# Altium schematic sheet Stingray.schdoc
size 543 x 428 mm
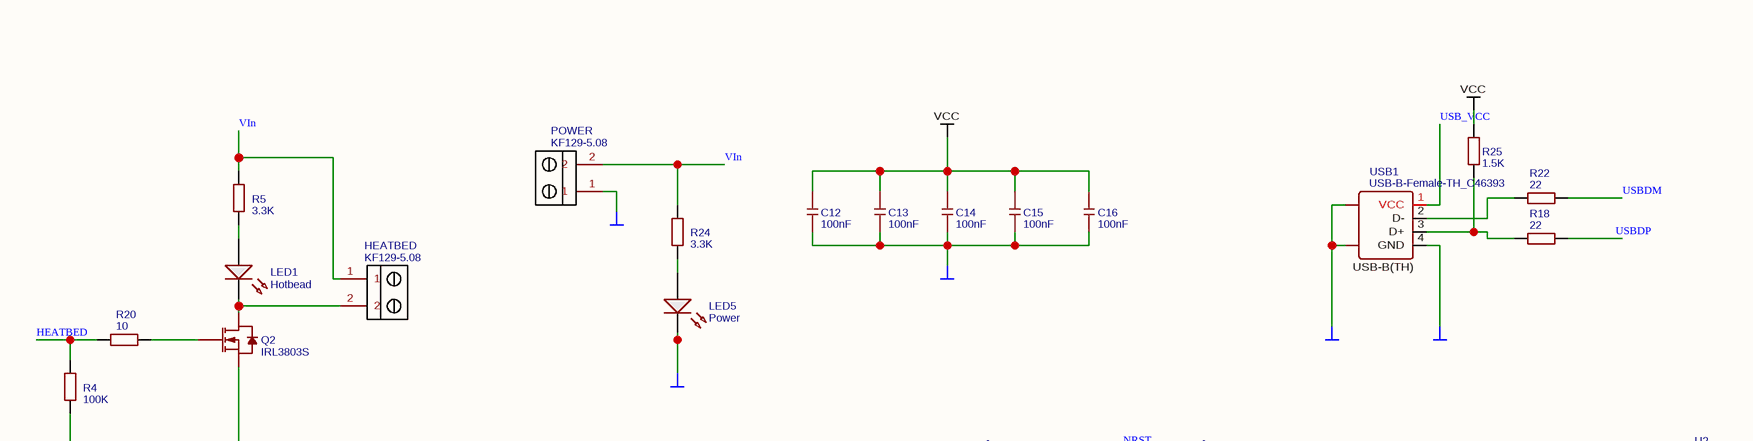
[diagram p0: Stingray.schdoc, top left]
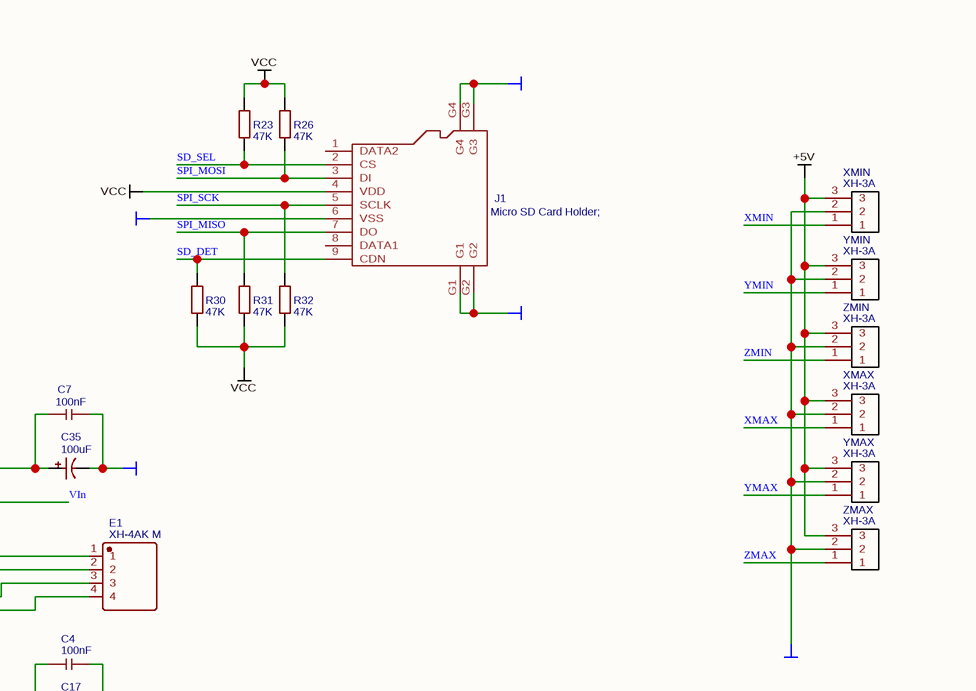
[diagram p1: Stingray.schdoc, top right]
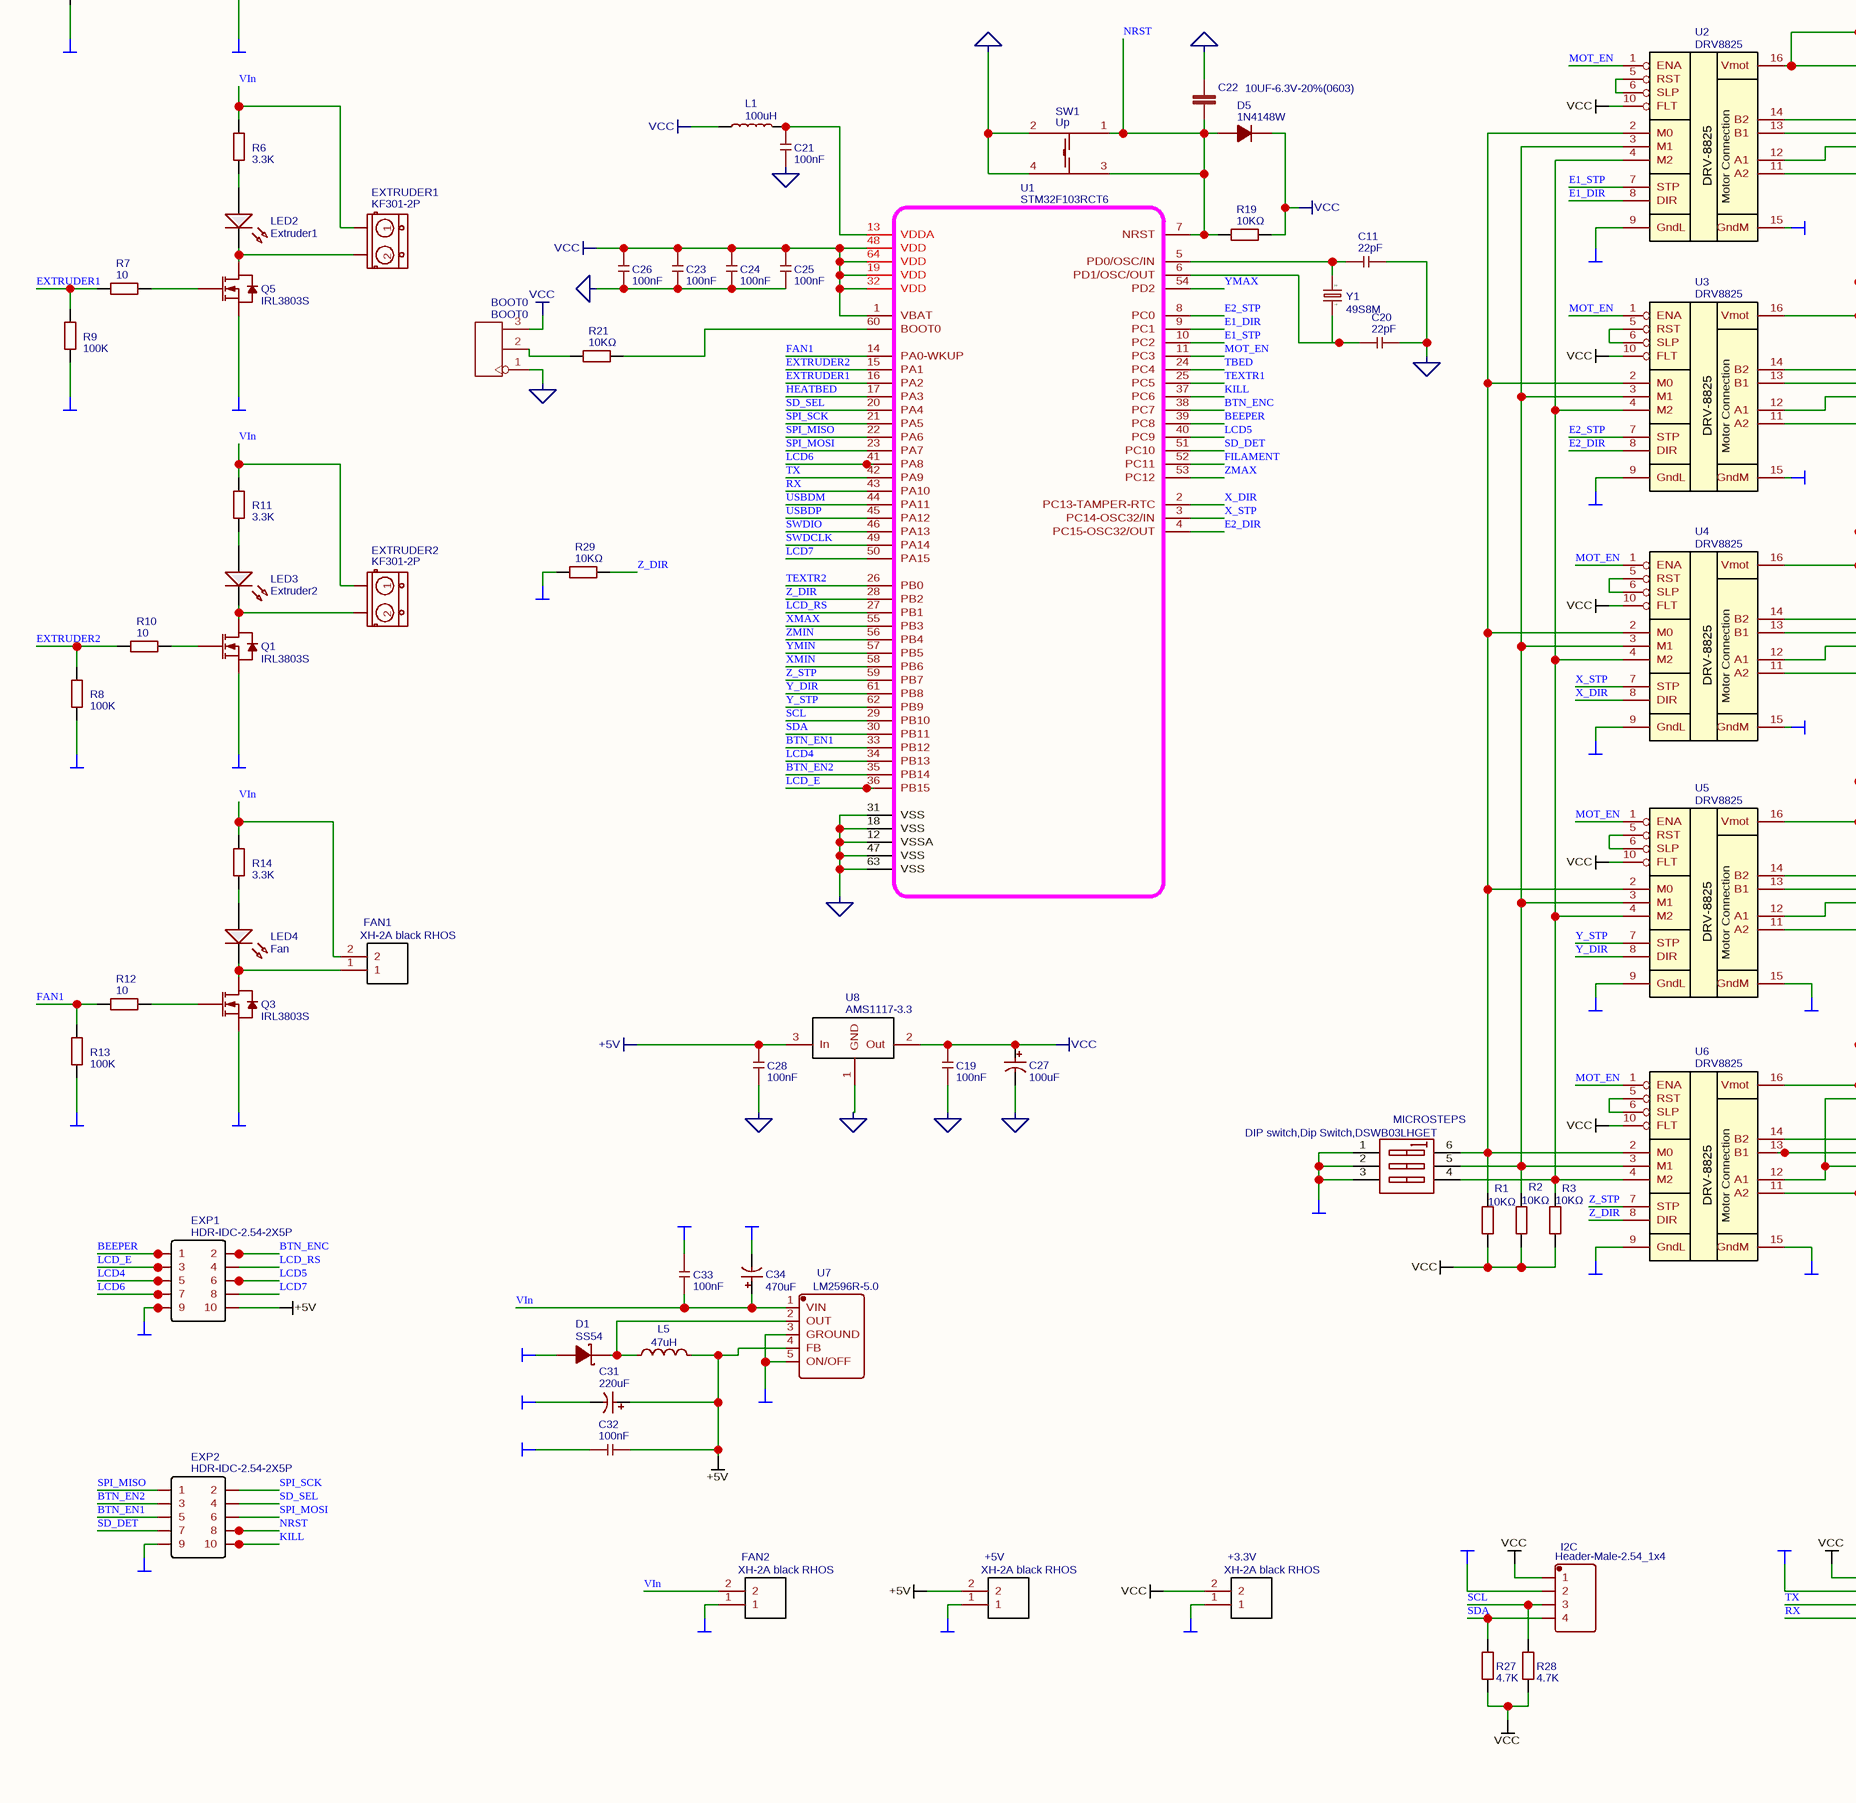
[diagram p2: Stingray.schdoc, bottom left]
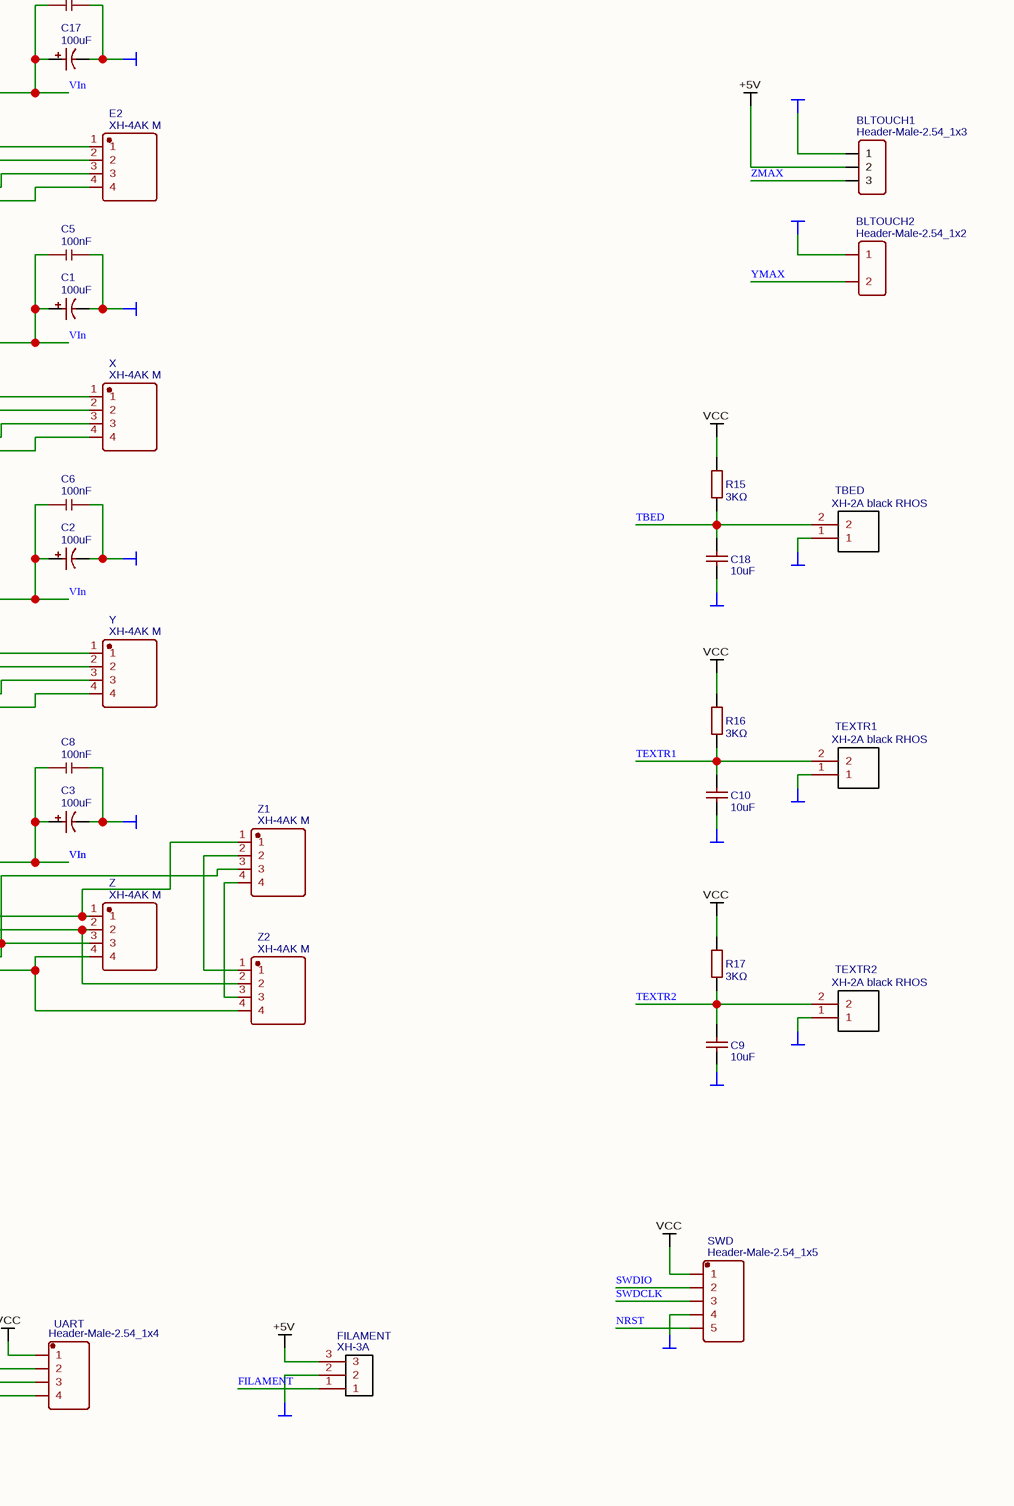
[diagram p3: Stingray.schdoc, bottom right]

## Parts
+3.3V  XH-2A black RHOS  [XH-2A]
+5V  XH-2A black RHOS  [XH-2A]
BLTOUCH1  Header-Male-2.54_1x3  [HDR-3X1/2.54]
BLTOUCH2  Header-Male-2.54_1x2  [HDR-2X1/2.54]
BOOT0  BOOT0  [H3-2.54]
C1  100uF  [CAP-D6.3XH7.7]
C2  100uF  [CAP-D6.3XH7.7]
C3  100uF  [CAP-D6.3XH7.7]
C4  100nF  [C0603]
C5  100nF  [C0603]
C6  100nF  [C0603]
C7  100nF  [C0603]
C8  100nF  [C0603]
C9  10uF  [0603]
C10  10uF  [0603]
C11  22pF  [C0603]
C12  100nF  [C0603]
C13  100nF  [C0603]
C14  100nF  [C0603]
C15  100nF  [C0603]
C16  100nF  [C0603]
C17  100uF  [CAP-D6.3XH7.7]
C18  10uF  [0603]
C19  100nF  [C0603]
C20  22pF  [C0603]
C21  100nF  [C0603]
C22  10UF-6.3V-20%(0603)  [0603-CAP]
C23  100nF  [C0603]
C24  100nF  [C0603]
C25  100nF  [C0603]
C26  100nF  [C0603]
C27  100uF  [CAP-D6.3XH5.5]
C28  100nF  [C0603]
C31  220uF  [CAP-D6.3XH5.5]
C32  100nF  [C0603]
C33  100nF  [C0603]
C34  470uF  [CAP-D12.5XH13.5]
C35  100uF  [CAP-D6.3XH7.7]
D1  SS54  [SMB(DO-214AA)]
D5  1N4148W  [SOD-123]
E1  XH-4AK M  [XH-4A]
E2  XH-4AK M  [XH-4A]
EXP1  HDR-IDC-2.54-2X5P  [HDR-IDC-2.54-2X5P]
EXP2  HDR-IDC-2.54-2X5P  [HDR-IDC-2.54-2X5P]
EXTRUDER1  KF301-2P  [KF301-2P]
EXTRUDER2  KF301-2P  [KF301-2P]
FAN1  XH-2A black RHOS  [XH-2A]
FAN2  XH-2A black RHOS  [XH-2A]
FILAMENT  XH-3A  [XH-3A]
HEATBED  KF129-5.08  [KF129-5.08]
I2C  Header-Male-2.54_1x4  [210S-1X4P]
J1  Micro SD Card Holder;  [MICRO-SD9+4P-SMD-16.1X14.5X1.85MM]
L1  100uH  [AXIAL-0.5]
L5  47uH  [SMD-10.0X10.0-10A50]
LED1  Hotbead  [LED-0805]
LED2  Extruder1  [LED-0805]
LED3  Extruder2  [LED-0805]
LED4  Fan  [LED-0805]
LED5  Power  [LED-0805]
MICROSTEPS  DIP switch,Dip Switch,DSWB03LHGET  [DSWB03LHGET]
POWER  KF129-5.08  [KF129-5.08]
Q1  IRL3803S  [TO-263-2-COLD]
Q2  IRL3803S  [TO-263-2-COLD]
Q3  IRL3803S  [TO-263-2-COLD]
Q5  IRL3803S  [TO-263-2-COLD]
R1  10KΩ  [0603]
R2  10KΩ  [0603]
R3  10KΩ  [0603]
R4  100K  [0603]
R5  3.3K  [0603]
R6  3.3K  [0603]
R7  10  [0603]
R8  100K  [0603]
R9  100K  [0603]
R10  10  [0603]
R11  3.3K  [0603]
R12  10  [0603]
R13  100K  [0603]
R14  3.3K  [0603]
R15  3KΩ  [0603]
R16  3KΩ  [0603]
R17  3KΩ  [0603]
R18  22  [0603]
R19  10KΩ  [0603]
R20  10  [0603]
R21  10KΩ  [0603]
R22  22  [0603]
R23  47K  [0603]
R24  3.3K  [0603]
R25  1.5K  [0603]
R26  47K  [0603]
R27  4.7K  [0603]
R28  4.7K  [0603]
R29  10KΩ  [0603]
R30  47K  [0603]
R31  47K  [0603]
R32  47K  [0603]
SW1  Up  [KEY-6.0*6.0]
SWD  Header-Male-2.54_1x5  [DIP-1X5P-2.54MM-M]
TBED  XH-2A black RHOS  [XH-2A]
TEXTR1  XH-2A black RHOS  [XH-2A]
TEXTR2  XH-2A black RHOS  [XH-2A]
U1  STM32F103RCT6  [LQFP64-0.5-10X10MM]
U2  DRV8825  [DRV8825]
U3  DRV8825  [DRV8825]
U4  DRV8825  [DRV8825]
U5  DRV8825  [DRV8825]
U6  DRV8825  [DRV8825]
U7  LM2596R-5.0  [TO-263-5-COLD]
U8  AMS1117-3.3  [SOT-223]
UART  Header-Male-2.54_1x4  [210S-1X4P]
USB1  USB-B-Female-TH_C46393  [USB-M-49]
X  XH-4AK M  [XH-4A]
XMAX  XH-3A  [XH-3A]
XMIN  XH-3A  [XH-3A]
Y  XH-4AK M  [XH-4A]
Y1  49S8M  [HC49US]
YMAX  XH-3A  [XH-3A]
YMIN  XH-3A  [XH-3A]
Z  XH-4AK M  [XH-4A]
Z1  XH-4AK M  [XH-4A]
Z2  XH-4AK M  [XH-4A]
ZMAX  XH-3A  [XH-3A]
ZMIN  XH-3A  [XH-3A]

## Nets
+5V: +5V.2 BLTOUCH1.2 C28.1 C31.1 C32.1 EXP1.10 FILAMENT.3 L5.2 U7.4(FB) U8.3(In) XMAX.3 XMIN.3 YMAX.3 YMIN.3 ZMAX.3 ZMIN.3
GND: +3.3V.1 +5V.1 BLTOUCH1.1 BLTOUCH2.1 BOOT0.1(P$1) C1.2 C2.2 C3.2 C4.2 C5.2 C6.2 C7.2 C8.2 C9.1 C10.1 C11.2 C12.2 C13.2 C14.2 C15.2 C16.2 C17.2 C18.1 C19.1 C20.2 C21.2 C22.1 C23.2 C24.2 C25.2 C26.2 C27.2 C28.2 C31.2 C32.2 C33.1 C34.2 C35.2 D1.1(A) EXP1.9 EXP2.9 FAN2.1 FILAMENT.2 I2C.2 J1.6(VSS) J1.G1 J1.G2 J1.G3 J1.G4 LED5.2(C) MICROSTEPS.1(A1) MICROSTEPS.2(A2) MICROSTEPS.3(A3) POWER.1 Q1.3(S) Q2.3(S) Q3.3(S) Q5.3(S) R4.2 R8.2 R9.2 R13.2 R29.2 SW1.2 SW1.4 SWD.4 TBED.1 TEXTR1.1 TEXTR2.1 U1.12(VSSA) U1.18(VSS) U1.31(VSS) U1.47(VSS) U1.63(VSS) U2.9(GndL) U2.15(GndM) U3.9(GndL) U3.15(GndM) U4.9(GndL) U4.15(GndM) U5.9(GndL) U5.15(GndM) U6.9(GndL) U6.15(GndM) U7.3(GROUND) U7.5(ON/OFF) U8.1(GND) UART.2 USB1.0 USB1.4(GND) XMAX.2 XMIN.2 YMAX.2 YMIN.2 ZMAX.2 ZMIN.2
VCC: +3.3V.2 BOOT0.3(P$3) C12.1 C13.1 C14.1 C15.1 C16.1 C19.2 C23.1 C24.1 C25.1 C26.1 C27.1 D5.2(K) I2C.1 J1.4(VDD) L1.1 R1.2 R2.2 R3.2 R15.2 R16.2 R17.2 R19.2 R23.1 R25.1 R26.1 R27.2 R28.2 R30.2 R31.2 R32.2 SWD.1 U1.1(VBAT) U1.19(VDD) U1.32(VDD) U1.48(VDD) U1.64(VDD) U2.10(FLT) U3.10(FLT) U4.10(FLT) U5.10(FLT) U6.10(FLT) U8.2(Out) UART.1
BEEPER: EXP1.1 U1.39(PC8)
BTN_EN1: EXP2.5 U1.33(PB12)
BTN_EN2: EXP2.3 U1.35(PB14)
BTN_ENC: EXP1.2 U1.38(PC7)
E1_DIR: U1.9(PC1) U2.8(DIR)
E1_STP: U1.10(PC2) U2.7(STP)
E2_DIR: U1.4(PC15-OSC32/OUT) U3.8(DIR)
E2_STP: U1.8(PC0) U3.7(STP)
EXTRUDER1: R7.2 R9.1 U1.16(PA2)
EXTRUDER2: R8.1 R10.2 U1.15(PA1)
FAN1: R12.2 R13.1 U1.14(PA0-WKUP)
FILAMENT: FILAMENT.1 U1.52(PC11)
HEATBED: R4.1 R20.2 U1.17(PA3)
KILL: EXP2.10 U1.37(PC6)
LCD4: EXP1.5 U1.34(PB13)
LCD5: EXP1.6 U1.40(PC9)
LCD6: EXP1.7 U1.41(PA8)
LCD7: EXP1.8 U1.50(PA15)
LCD_E: EXP1.3 U1.36(PB15)
LCD_RS: EXP1.4 U1.27(PB1)
MOT_EN: U1.11(PC3) U2.1(ENA) U3.1(ENA) U4.1(ENA) U5.1(ENA) U6.1(ENA)
NRST: C22.2 D5.1(A) EXP2.8 R19.1 SW1.1 SW1.3 SWD.5 U1.7(NRST)
RX: U1.43(PA10) UART.4
SCL: I2C.3 R28.1 U1.29(PB10)
SD_DET: EXP2.7 J1.9(CDN) R30.1 U1.51(PC10)
SD_SEL: EXP2.4 J1.2(CS) R23.2 U1.20(PA4)
SDA: I2C.4 R27.1 U1.30(PB11)
SPI_MISO: EXP2.1 J1.7(DO) R31.1 U1.22(PA6)
SPI_MOSI: EXP2.6 J1.3(DI) R26.2 U1.23(PA7)
SPI_SCK: EXP2.2 J1.5(SCLK) R32.1 U1.21(PA5)
SWDCLK: SWD.3 U1.49(PA14)
SWDIO: SWD.2 U1.46(PA13)
TBED: C18.2 R15.1 TBED.2 U1.24(PC4)
TEXTR1: C10.2 R16.1 TEXTR1.2 U1.25(PC5)
TEXTR2: C9.2 R17.1 TEXTR2.2 U1.26(PB0)
TX: U1.42(PA9) UART.3
USB_VCC: USB1.1(VCC)
USBDM: R22.1 U1.44(PA11)
USBDP: R18.1 U1.45(PA12)
VIn: C1.1 C2.1 C3.1 C4.1 C5.1 C6.1 C7.1 C8.1 C17.1 C33.2 C34.1 C35.1 EXTRUDER1.1 EXTRUDER2.1 FAN1.2 FAN2.2 HEATBED.1 POWER.2 R5.1 R6.1 R11.1 R14.1 R24.1 U2.16(Vmot) U3.16(Vmot) U4.16(Vmot) U5.16(Vmot) U6.16(Vmot) U7.1(VIN)
X_DIR: U1.2(PC13-TAMPER-RTC) U4.8(DIR)
X_STP: U1.3(PC14-OSC32/IN) U4.7(STP)
XMAX: U1.55(PB3) XMAX.1
XMIN: U1.58(PB6) XMIN.1
Y_DIR: U1.61(PB8) U5.8(DIR)
Y_STP: U1.62(PB9) U5.7(STP)
YMAX: BLTOUCH2.2 U1.54(PD2) YMAX.1
YMIN: U1.57(PB5) YMIN.1
Z_DIR: R29.1 U1.28(PB2) U6.8(DIR)
Z_STP: U1.59(PB7) U6.7(STP)
ZMAX: BLTOUCH1.3 U1.53(PC12) ZMAX.1
ZMIN: U1.56(PB4) ZMIN.1
NetBOOT0_2: BOOT0.2(P$2) R21.2
NetC11_1: C11.1 U1.5(PD0/OSC/IN) Y1.2
NetC20_1: C20.1 U1.6(PD1/OSC/OUT) Y1.1
NetC21_1: C21.1 L1.2 U1.13(VDDA)
NetD1_2: D1.2(K) L5.1 U7.2(OUT)
NetE1_1: E1.1 U2.14(B2)
NetE1_2: E1.2 U2.13(B1)
NetE1_3: E1.3 U2.12(A1)
NetE1_4: E1.4 U2.11(A2)
NetE2_1: E2.1 U3.14(B2)
NetE2_2: E2.2 U3.13(B1)
NetE2_3: E2.3 U3.12(A1)
NetE2_4: E2.4 U3.11(A2)
NetEXTRUDER1_2: EXTRUDER1.2 LED2.2(C) Q5.4(D)
NetEXTRUDER2_2: EXTRUDER2.2 LED3.2(C) Q1.4(D)
NetFAN1_1: FAN1.1 LED4.2(C) Q3.4(D)
NetHEATBED_2: HEATBED.2 LED1.2(C) Q2.4(D)
NetLED1_1: LED1.1(A) R5.2
NetLED2_1: LED2.1(A) R6.2
NetLED3_1: LED3.1(A) R11.2
NetLED4_1: LED4.1(A) R14.2
NetLED5_1: LED5.1(A) R24.2
NetMICROSTEPS_4: MICROSTEPS.4(B3) R3.1 U2.4(M2) U3.4(M2) U4.4(M2) U5.4(M2) U6.4(M2)
NetMICROSTEPS_5: MICROSTEPS.5(B2) R2.1 U2.3(M1) U3.3(M1) U4.3(M1) U5.3(M1) U6.3(M1)
NetMICROSTEPS_6: MICROSTEPS.6(B1) R1.1 U2.2(M0) U3.2(M0) U4.2(M0) U5.2(M0) U6.2(M0)
NetQ1_1: Q1.1(G) R10.1
NetQ2_1: Q2.1(G) R20.1
NetQ3_1: Q3.1(G) R12.1
NetQ5_1: Q5.1(G) R7.1
NetR18_2: R18.2 R25.2 USB1.3(D+)
NetR21_1: R21.1 U1.60(BOOT0)
NetR22_2: R22.2 USB1.2(D-)
NetU2_5: U2.5(RST) U2.6(SLP)
NetU3_5: U3.5(RST) U3.6(SLP)
NetU4_5: U4.5(RST) U4.6(SLP)
NetU4_11: U4.11(A2) X.4
NetU4_12: U4.12(A1) X.3
NetU4_13: U4.13(B1) X.2
NetU4_14: U4.14(B2) X.1
NetU5_5: U5.5(RST) U5.6(SLP)
NetU5_11: U5.11(A2) Y.4
NetU5_12: U5.12(A1) Y.3
NetU5_13: U5.13(B1) Y.2
NetU5_14: U5.14(B2) Y.1
NetU6_5: U6.5(RST) U6.6(SLP)
NetU6_11: U6.11(A2) Z.4 Z2.4
NetU6_12: U6.12(A1) Z.3 Z1.3
NetU6_13: U6.13(B1) Z.2 Z2.2
NetU6_14: U6.14(B2) Z.1 Z1.1
NetZ1_2: Z1.2 Z2.1
NetZ1_4: Z1.4 Z2.3

Not connected (* = marked no-connect by the designer): J1 1(DATA2) 8(DATA1)

## Notes on the sheet
- (in symbol DRV8825) DRV-8825; Motor Connection
- (in symbol USB-B-Female-TH_C46393) USB-B(TH)

## Library data of the parts
+3.3V +5V FAN1 FAN2 TBED TEXTR1 TEXTR2 = XH-2A black RHOS: BOM_Manufacturer: BOOMELE; Contributor: LCSC; BOM_Supplier: LCSC; BOM_Manufacturer Part: XH-2A black RHOS; image: //image.lceda.cn/szlcsc/C24193.jpg; BOM_Supplier Part: C24193; spicePre: J
BLTOUCH1 = Header-Male-2.54_1x3: BOM_Manufacturer: BOOMELE; BOM_Manufacturer Part: Header2.54mm 1*3P; BOM_Supplier: LCSC; image: //image.lceda.cn/szlcsc/C49257.jpg; BOM_Supplier Part: C49257; spicePre: P
BLTOUCH2 = Header-Male-2.54_1x2: BOM_Manufacturer: TE Connectivity; BOM_Manufacturer Part: 826629-2; BOM_Supplier: LCSC; image: //image.lceda.cn/szlcsc/C86471.jpg; BOM_Supplier Part: C86471; spicePre: H
BOOT0 = BOOT0: catid: 20; description: DIP-Black-Male-Header-VERT-3P; BOM_Manufacturer Part: ?; spicePre: C
C1-C3 C17 C35 = 100uF: BOM_Manufacturer: CHENGX; BOM_Manufacturer Part: UT1V101M0607VG; nameAlias: Capacitance; BOM_Supplier: LCSC; BOM_Supplier Part: C82002; spicePre: C; spiceSymbolName: UT1V101M0607VG
C4-C8 C12-C16 = 100nF: BOM_Manufacturer Part: 0603B104K500NT; BOM_Manufacturer: FH; catid: 20; description: SMD CAP Ceramic 100nF-50V-10%-X7R; spicePre: C; BOM_Supplier: LCSC; BOM_Supplier Part: C30926
C9 C10 C18 = 10uF: BOM_Manufacturer: SAMSUNG; BOM_Manufacturer Part: CL10A106MO8NQNC; nameAlias: Capacitance; BOM_Supplier: LCSC; BOM_Supplier Part: C92487; spicePre: C; spiceSymbolName: CL10A106MO8NQNC
C11 C20 = 22pF: BOM_Manufacturer Part: CC0603JRNPO9BN150; catid: 20; description: SMD CAP Ceramic 15pF-50V-5%-NPO;0603; spicePre: C
C19 C21 C23-C26 C28 C32 C33 = 100nF: BOM_Manufacturer Part: CC0603KRX7R9BB104; catid: 20; description: SMD CAP Ceramic 100nF-50V-10%-X7R; spicePre: C
C22 = 10UF-6.3V-20%(0603): catid: 20; Contributor: SparkFun; BOM_Manufacturer Part: ?; spicePre: C
C27 = 100uF: BOM_Manufacturer: CapXon; BOM_Manufacturer Part: MV101M6R3E055A; nameAlias: Capacitance; BOM_Supplier: LCSC; BOM_Supplier Part: C65207; spicePre: C; spiceSymbolName: MV101M6R3E055A
C31 = 220uF: BOM_Manufacturer: CHENGX; BOM_Manufacturer Part: UT1A221M0605VG; nameAlias: Capacitance; BOM_Supplier: LCSC; BOM_Supplier Part: C81994; spicePre: C; spiceSymbolName: UT1A221M0605VG
C34 = 470uF: BOM_Manufacturer: ROQANG; BOM_Manufacturer Part: RVT1V681M1213; nameAlias: Capacitance; BOM_Supplier: LCSC; BOM_Supplier Part: C98216; spicePre: C; spiceSymbolName: RVT1V681M1213
D1 = SS54: BOM_Manufacturer: MDD; BOM_Supplier: LCSC; BOM_Manufacturer Part: SS54; image: //image.lceda.cn/szlcsc/C32513.jpg; BOM_Supplier Part: C32513; spicePre: D
D5 = 1N4148W: BOM_Manufacturer: LCSC; BOM_Supplier: LCSC; BOM_Manufacturer Part: 1N4148W; spicePre: D; BOM_Supplier Part: C89641
E1 E2 X Y Z Z1 Z2 = XH-4AK M: BOM_Manufacturer: Boom Precision Elec; Contributor: LCSC; BOM_Supplier: LCSC; BOM_Supplier Part: C146106; BOM_Manufacturer Part: -; spicePre: C
EXP1 EXP2 = HDR-IDC-2.54-2X5P: BOM_Manufacturer: BOOMELE; BOM_Manufacturer Part: IDC Box 2.54mm 2X5P; BOM_Supplier: LCSC; image: //image.lceda.cn/szlcsc/C5665.jpg; BOM_Supplier Part: C5665; spicePre: P
EXTRUDER1 EXTRUDER2 = KF301-2P: Contributor: vonk0031; sourceId: Z5gQ20Ay7; timeStamp: 1465982779; BOM_Manufacturer Part: ?; spicePre: U
FILAMENT XMAX XMIN YMAX YMIN ZMAX ZMIN = XH-3A: BOM_Manufacturer: BOOMELE; Contributor: LCSC; BOM_Supplier: LCSC; BOM_Manufacturer Part: XH-3A; image: //image.lceda.cn/szlcsc/C2316.jpg; BOM_Supplier Part: C2316; spicePre: P
HEATBED POWER = KF129-5.08: Contributor: mmaygli; BOM_Manufacturer Part: KF129-5.08; spicePre: U
I2C UART = Header-Male-2.54_1x4: BOM_Manufacturer: Ckmtw; BOM_Manufacturer Part: 210S-1*4P L=11.6MMGold-plated black; Contributor: LCSC; BOM_Supplier: LCSC; BOM_Supplier Part: C124378; spicePre: H
L1 = 100uH: BOM_Manufacturer: FH; BOM_Manufacturer Part: LGA0410-102KP52E; Value: 1000uH; Tolerance: ±10%; BOM_Supplier: LCSC; spicePre: L; BOM_Supplier Part: C72360
L5 = 47uH: BOM_Manufacturer: COILANK INTERNATIONAL; BOM_Manufacturer Part: ABG10A50M470; nameAlias: Inductance; Contributor: LCSC; BOM_Supplier: LCSC; BOM_Supplier Part: C253613; spicePre: L; spiceSymbolName: ABG10A50M470
LED1 = Hotbead: BOM_Manufacturer: EVERLIGHT; BOM_Manufacturer Part: 17-21/GHC-YR1S2/3T; BOM_Supplier: EasyEDA; spicePre: L; BOM_Supplier Part: E73546
LED2 = Extruder1: BOM_Manufacturer: EVERLIGHT; BOM_Manufacturer Part: 17-21/GHC-YR1S2/3T; BOM_Supplier: EasyEDA; spicePre: L; BOM_Supplier Part: E73546
LED3 = Extruder2: BOM_Manufacturer: EVERLIGHT; BOM_Manufacturer Part: 17-21/GHC-YR1S2/3T; BOM_Supplier: EasyEDA; spicePre: L; BOM_Supplier Part: E73546
LED4 = Fan: BOM_Manufacturer: EVERLIGHT; BOM_Manufacturer Part: 17-21/GHC-YR1S2/3T; BOM_Supplier: EasyEDA; spicePre: L; BOM_Supplier Part: E73546
LED5 = Power: BOM_Manufacturer: EVERLIGHT; BOM_Manufacturer Part: 17-21/GHC-YR1S2/3T; BOM_Supplier: EasyEDA; spicePre: L; BOM_Supplier Part: E73546
MICROSTEPS = DIP switch,Dip Switch,DSWB03LHGET: BOM_Manufacturer: KE; Contributor: LCSC; BOM_Supplier: LCSC; BOM_Manufacturer Part: DIP switch,Dip Switch,DSWB03LHGET; BOM_Supplier Part: C99420; spicePre: S
Q1-Q3 Q5 = IRL3803S: BOM_Manufacturer: IR; BOM_Supplier: LCSC; BOM_Manufacturer Part: IRL3803S; BOM_Supplier Part: C2669; spicePre: Q
R1-R3 R19 R21 R29 = 10KΩ: BOM_Manufacturer: UniOhm; BOM_Manufacturer Part: 0603WAF1002T5E; Power: 1/10W; Tolerance: ±1%; Value: 10KΩ; BOM_Supplier: LCSC; BOM_LCSC Assembly: Yes; spicePre: R; BOM_Supplier Part: C25804
R4 R8 R9 R13 = 100K: BOM_Manufacturer: UniOhm; BOM_Manufacturer Part: 0603WAF1002T5E; Power: 1/10W; Value: 10KΩ; Tolerance: ±1%; BOM_Supplier: LCSC; BOM_LCSC Assembly: Yes; spicePre: R; BOM_Supplier Part: C25804
R5 R6 R11 R14 R24 = 3.3K: BOM_Manufacturer: UniOhm; BOM_Manufacturer Part: 0603WAF1002T5E; Power: 1/10W; Value: 10KΩ; Tolerance: ±1%; BOM_Supplier: LCSC; BOM_LCSC Assembly: Yes; spicePre: R; BOM_Supplier Part: C25804
R7 R10 R12 R20 = 10: BOM_Manufacturer: UniOhm; BOM_Manufacturer Part: 0603WAF1002T5E; Power: 1/10W; Value: 10KΩ; Tolerance: ±1%; BOM_Supplier: LCSC; BOM_LCSC Assembly: Yes; spicePre: R; BOM_Supplier Part: C25804
R15-R17 = 3KΩ: BOM_Manufacturer: KOA; BOM_Manufacturer Part: RK73B1JTTD302J; nameAlias: Value; Contributor: LCSC; BOM_Supplier: LCSC; BOM_Supplier Part: C131708; spicePre: R; spiceSymbolName: RK73B1JTTD302J
R18 R22 = 22: BOM_Manufacturer: UniOhm; BOM_Manufacturer Part: 0603WAF1002T5E; Power: 1/10W; Value: 10KΩ; Tolerance: ±1%; BOM_Supplier: LCSC; BOM_LCSC Assembly: Yes; spicePre: R; BOM_Supplier Part: C25804
R23 R26 R30-R32 = 47K: BOM_Manufacturer: UniOhm; BOM_Manufacturer Part: 0603WAF1002T5E; Power: 1/10W; Value: 10KΩ; Tolerance: ±1%; BOM_Supplier: LCSC; BOM_LCSC Assembly: Yes; spicePre: R; BOM_Supplier Part: C25804
R25 = 1.5K: BOM_Manufacturer: UniOhm; BOM_Manufacturer Part: 0603WAF1002T5E; Power: 1/10W; Value: 10KΩ; Tolerance: ±1%; BOM_Supplier: LCSC; BOM_LCSC Assembly: Yes; spicePre: R; BOM_Supplier Part: C25804
R27 R28 = 4.7K: BOM_Manufacturer: UniOhm; BOM_Manufacturer Part: 0603WAF1002T5E; Power: 1/10W; Value: 10KΩ; Tolerance: ±1%; BOM_Supplier: LCSC; BOM_LCSC Assembly: Yes; spicePre: R; BOM_Supplier Part: C25804
SW1 = Up: BOM_Manufacturer: BBJ; BOM_Manufacturer Part: Switch,6*6*5Plastic head,260G, 0.25mm,DIP2; Contributor: LCSC; BOM_Supplier: LCSC; spicePre: S; BOM_Supplier Part: C71845
SWD = Header-Male-2.54_1x5: BOM_Manufacturer: Ckmtw; BOM_Manufacturer Part: 210S-1*5P L=11.6MMGold-plated black; Contributor: LCSC; BOM_Supplier: LCSC; BOM_Supplier Part: C124379; spicePre: H
U1 = STM32F103RCT6: catid: 20; BOM_Manufacturer Part: ?; spicePre: U
U2-U6 = DRV8825: Contributor: Origami30; BOM_Manufacturer Part: DRV8825; BOM_Supplier Part: 2133; BOM_Supplier: Pololu; link: https://www.pololu.com/product/2133; spicePre: U
U7 = LM2596R-5.0: BOM_Manufacturer: HTC; BOM_Supplier: LCSC; BOM_Manufacturer Part: LM2596R-5.0; BOM_Supplier Part: C77782; spicePre: U
U8 = AMS1117-3.3: BOM_Manufacturer: AMS; sourceId: dwIGgezVh; timeStamp: 1476261164; BOM_Supplier: LCSC; BOM_Manufacturer Part: AMS1117-3.3; spicePre: U; BOM_Supplier Part: C6186
USB1 = USB-B-Female-TH_C46393: BOM_Manufacturer Part: USB-B-Female-90-TH; BOM_Supplier: LCSC; image: //image.lceda.cn/szlcsc/C46393.jpg; BOM_Supplier Part: C46393; spicePre: U
Y1 = 49S8M: catid: 20; description: DIP Crystal 8MHz-20pF-20ppm-60R;; BOM_Manufacturer Part: 49S8M; spicePre: Y
J1 = Micro SD Card Holder;: description: Micro SD Card Holder;; BOM_Manufacturer Part: ?; spicePre: J